# Altium schematic sheet sch_gsm.SchDoc
size B; SheetNumber: 4; SheetTotal: 7
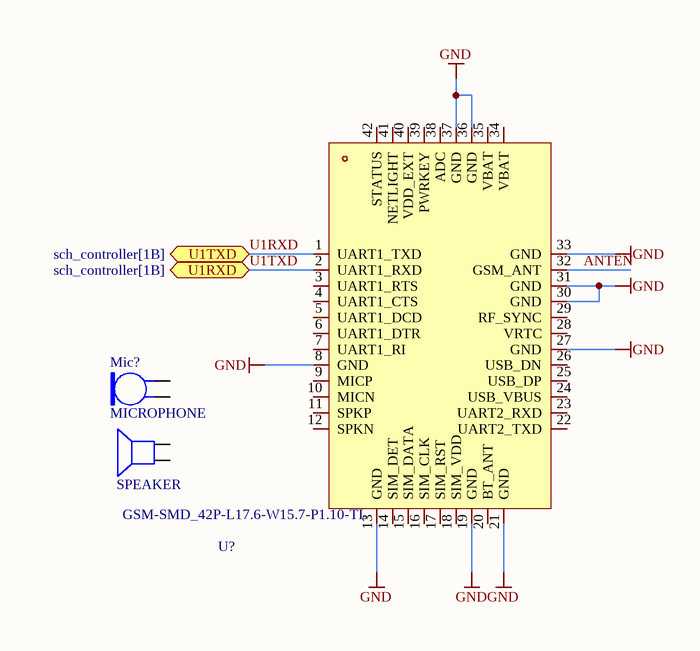
[diagram p0: sch_gsm.SchDoc]

## Parts
?  SPEAKER
Mic?  MICROPHONE  [Model Name]
U?  GSM-SMD_42P-L17.6-W15.7-P1.10-TL  [GSM-SMD_42P-L17.6-W15.7-P1.10-TL]

## Ports
U1RXD (bidir, see sch_controller[1B]), U1TXD (bidir, see sch_controller[1B])

## Nets
GND: U?.8(GND) U?.13(GND) U?.19(GND) U?.21(GND) U?.27(GND) U?.30(GND) U?.31(GND) U?.33(GND) U?.36(GND) U?.37(GND)
ANTEN: U?.32(GSM_ANT)
U1RXD: U?.1(UART1_TXD) ; port U1TXD
U1TXD: U?.2(UART1_RXD) ; port U1RXD

Not connected (* = marked no-connect by the designer): ? 1 2; Mic? 1 2; U? 3(UART1_RTS) 4(UART1_CTS) 5(UART1_DCD) 6(UART1_DTR) 7(UART1_RI) 9(MICP) 10(MICN) 11(SPKP) 12(SPKN) 14(SIM_DET) 15(SIM_DATA) 16(SIM_CLK) 17(SIM_RST) 18(SIM_VDD) 20(BT_ANT) 22(UART2_TXD) 23(UART2_RXD) 24(USB_VBUS) 25(USB_DP) 26(USB_DN) 28(VRTC) 29(RF_SYNC) 34(VBAT) 35(VBAT) 38(ADC) 39(PWRKEY) 40(VDD_EXT) 41(NETLIGHT) 42(STATUS)

## Library data of the parts
U? = SIM800C_C2981431: MFAC: SIM800C; JLC: C2981431